# Altium schematic sheet SCH-00005-6.SchDoc: Test System DIN Connector
size 403 x 281 mm
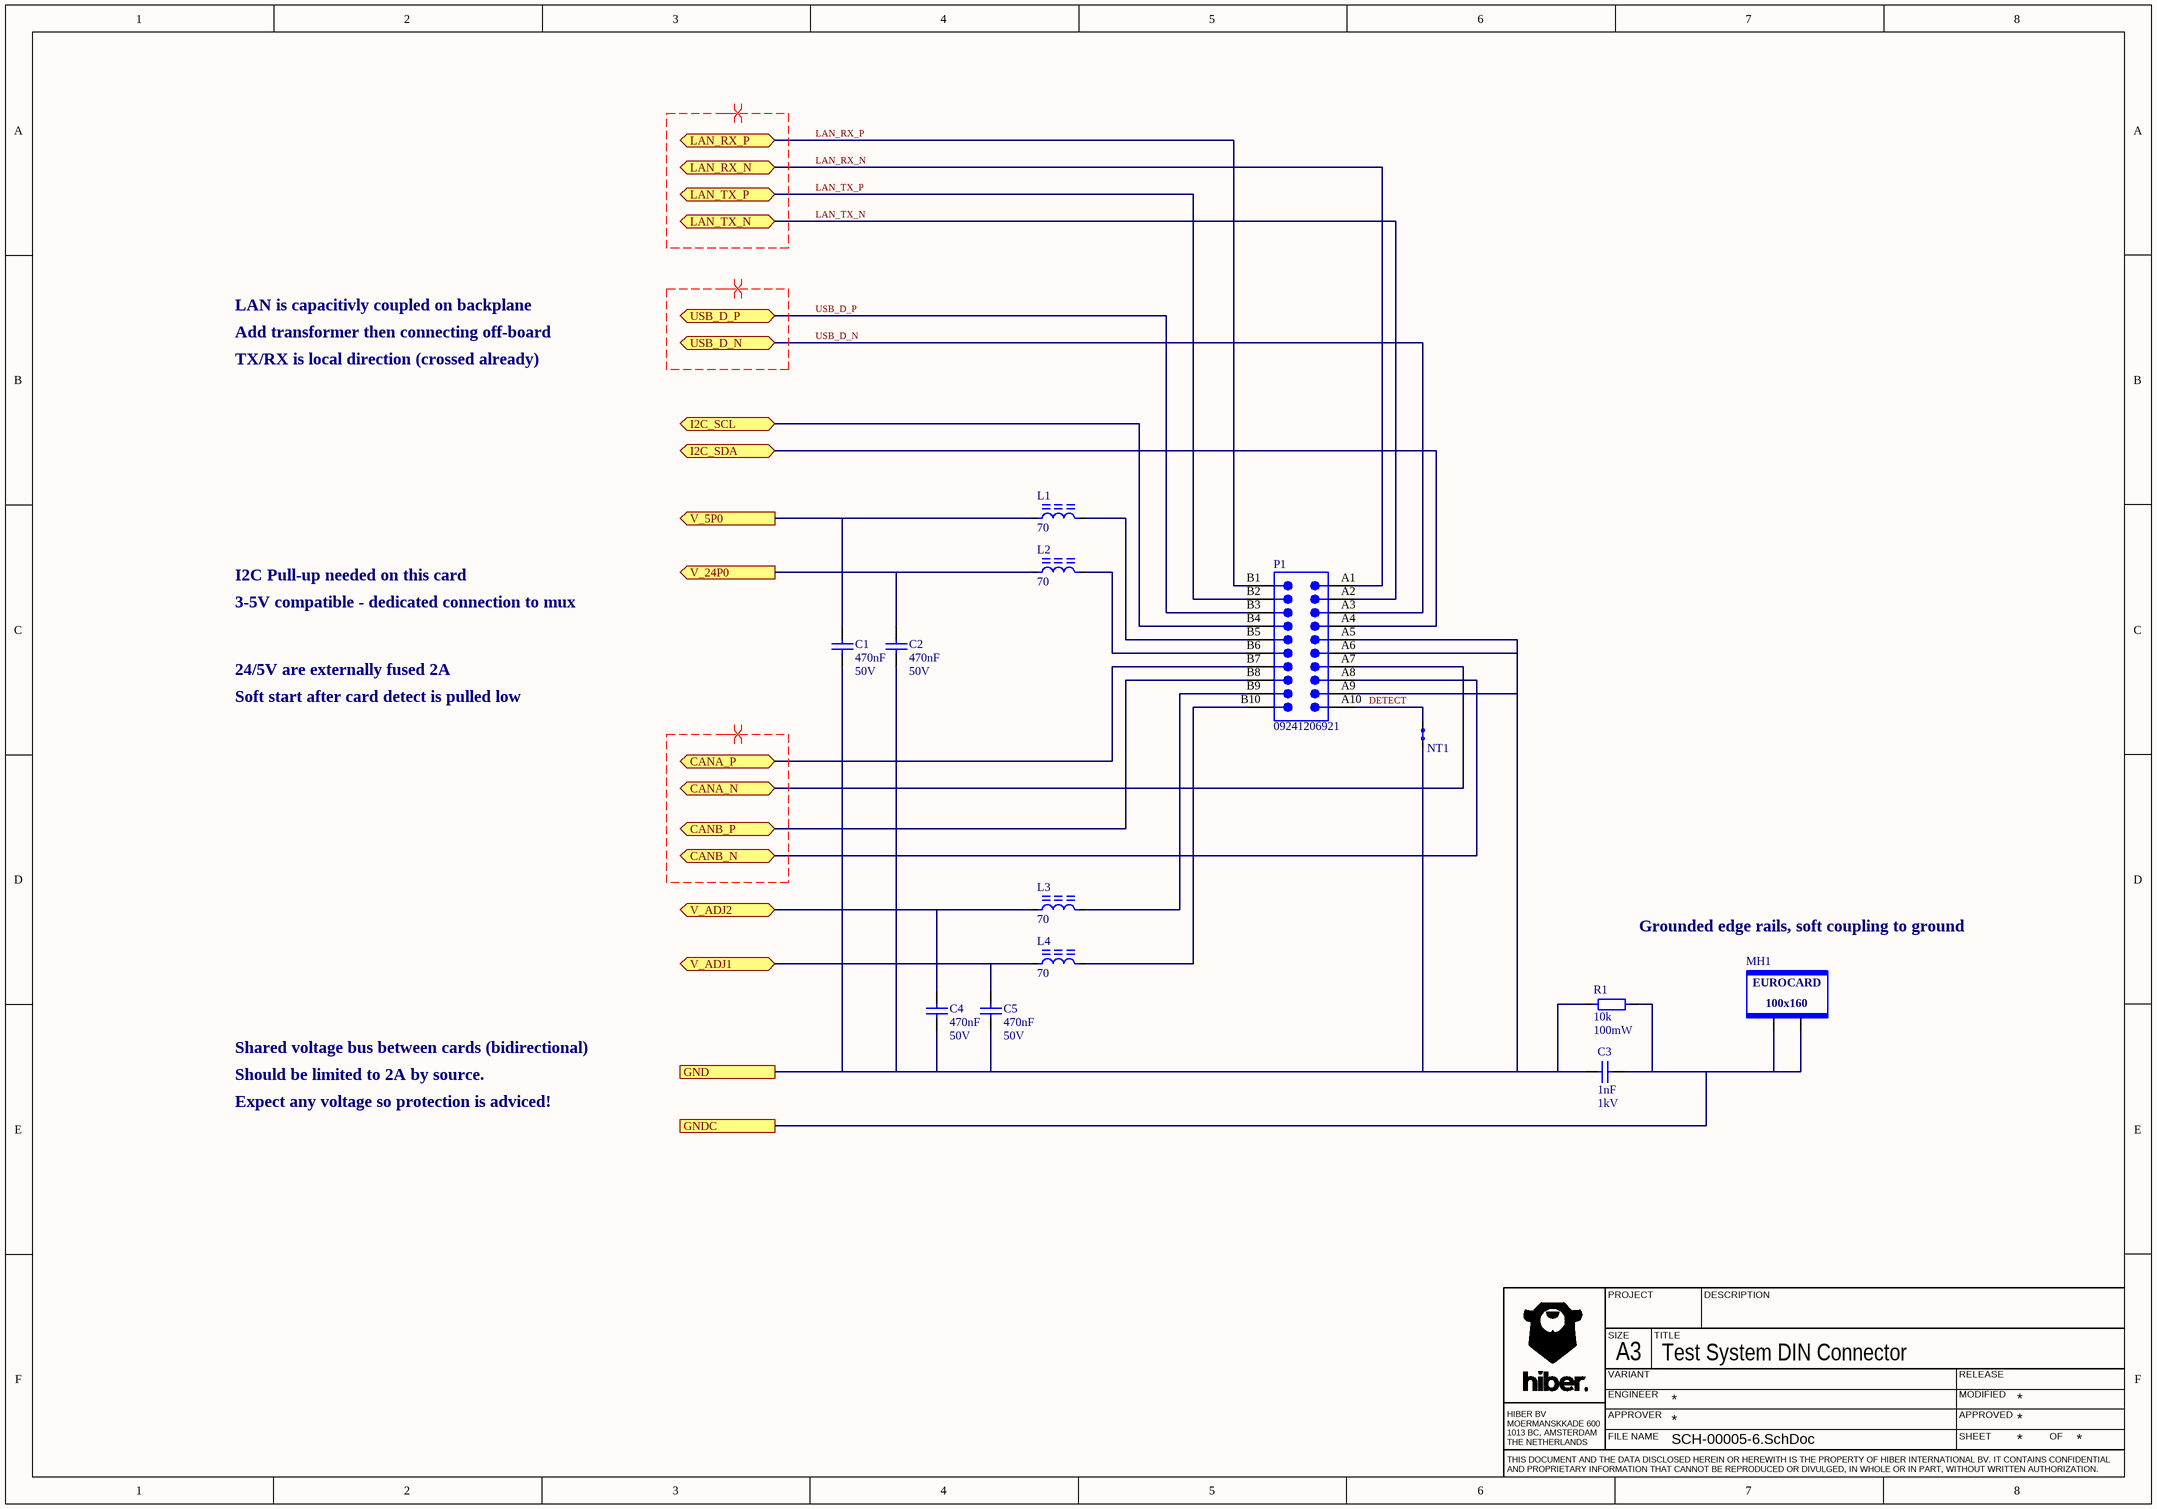
[diagram p0: SCH-00005-6.SchDoc]

## Parts
C1  value 470nF  Rated Voltage: 50V  [CAPC200X125X110L50N]  (hidden comment: C0805C474K5RACTU)
C2  value 470nF  Rated Voltage: 50V  [CAPC200X125X110L50N]  (hidden comment: C0805C474K5RACTU)
C3  value 1nF  Rated Voltage: 1kV  [CAPC160X80X87L35N]  (hidden comment: C0603W102KDRACAUTO)
C4  value 470nF  Rated Voltage: 50V  [CAPC200X125X110L50N]  (hidden comment: C0805C474K5RACTU)
C5  value 470nF  Rated Voltage: 50V  [CAPC200X125X110L50N]  (hidden comment: C0805C474K5RACTU)
L1  Impedance: 70  [BEADC200X125X105L50N]  (hidden comment: BLM21SP700SH1D)
L2  Impedance: 70  [BEADC200X125X105L50N]  (hidden comment: BLM21SP700SH1D)
L3  Impedance: 70  [BEADC200X125X105L50N]  (hidden comment: BLM21SP700SH1D)
L4  Impedance: 70  [BEADC200X125X105L50N]  (hidden comment: BLM21SP700SH1D)
MH1  EUROCARD_160X100  [EUROCARD_100X160]  (value not drawn)
NT1  NET-TIE  [NT200]  (value not drawn)  (net tie, no BOM)
P1  09241206921  [HARTING_09241206921]
R1  value 10k  Rated Power: 100mW  [RESC160X85X55L30N]  (hidden comment: TNPW060310K0BEEA)

## Ports
CANA_N (bidir), CANA_P (bidir), CANB_N (bidir), CANB_P (bidir), GND, GNDC, I2C_SCL (bidir), I2C_SDA (bidir), LAN_RX_N (bidir), LAN_RX_P (bidir), LAN_TX_N (bidir), LAN_TX_P (bidir), USB_D_N (bidir), USB_D_P (bidir), V_5P0 (out), V_24P0 (out), V_ADJ1 (bidir), V_ADJ2 (bidir)

## Nets
CANA_N: P1.A7 ; port CANA_N
CANA_P: P1.B7 ; port CANA_P
CANB_N: P1.A8 ; port CANB_N
CANB_P: P1.B8 ; port CANB_P
DETECT: NT1.2 P1.A10
GND: C1.1 C2.1 C3.2 C4.1 C5.1 NT1.1 P1.A5 P1.A6 P1.A9 R1.1 ; port GND
GNDC: C3.1 MH1.1 MH1.2 R1.2 ; port GNDC
I2C_SCL: P1.B4 ; port I2C_SCL
I2C_SDA: P1.A4 ; port I2C_SDA
LAN_RX_N: P1.A1 ; port LAN_RX_N
LAN_RX_P: P1.B1 ; port LAN_RX_P
LAN_TX_N: P1.A2 ; port LAN_TX_N
LAN_TX_P: P1.B2 ; port LAN_TX_P
USB_D_N: P1.A3 ; port USB_D_N
USB_D_P: P1.B3 ; port USB_D_P
V_5P0: C1.2 L1.1 ; port V_5P0
V_24P0: C2.2 L2.1 ; port V_24P0
V_ADJ1: C5.2 L4.1 ; port V_ADJ1
V_ADJ2: C4.2 L3.1 ; port V_ADJ2
NetL1_2: L1.2 P1.B5
NetL2_2: L2.2 P1.B6
NetL3_2: L3.2 P1.B9
NetL4_2: L4.2 P1.B10

## Layout directives
differential pair; differential pair class DIFF_LAN: (no net found under the mark)
differential pair; differential pair class DIFF_USB: (no net found under the mark)

## Notes on the sheet
- LAN is capacitivly coupled on backplane
- Add transformer then connecting off-board
- TX/RX is local direction (crossed already)
- I2C Pull-up needed on this card
- 3-5V compatible - dedicated connection to mux
- 24/5V are externally fused 2A
- Soft start after card detect is pulled low
- Grounded edge rails, soft coupling to ground
- Shared voltage bus between cards (bidirectional)
- Should be limited to 2A by source.
- Expect any voltage so protection is adviced!
- PROJECT
- DESCRIPTION
- SIZE
- ENGINEER
- VARIANT
- A3
- TITLE
- MODIFIED
- RELEASE
- HIBER BV
  MOERMANSKKADE 600
  1013 BC, AMSTERDAM
  THE NETHERLANDS
- FILE NAME
- APPROVER
- SHEET
- APPROVED
- OF
- THIS DOCUMENT AND THE DATA DISCLOSED HEREIN OR HEREWITH IS THE PROPERTY OF HIBER INTERNATIONAL BV. IT CONTAINS CONFIDENTIAL AND PROPRIETARY INFORMATION THAT CANNOT BE REPRODUCED OR DIVULGED, IN WHOLE OR IN PART, WITHOUT WRITTEN AUTHORIZATION.
- (in symbol CMP-01155-4) 100x160

## Library data of the parts
C1 C2 C4 C5 = CMP-00607-1: CAP Standard 0805 (2012) 470,0nF 50V X7R (Standard); Type: Ceramic; Tolerance: 10%; Termination Finish: 100% Matte Sn; Qualification: Standard; Mount: Surface Mount; Pins: 2; Case/Package: 0805 (2012); Dielectric: X7R; RoHS: Yes; Failure Rate: N/A
C3 = CMP-00534-3: CAP Automotive 0603 (1608) 1,0nF 1kV X7R (ArcShield with Flexible Termination); Tolerance: 10%; Type: Ceramic; Mount: SMD; Pins: 2; Dielectric: X7R; Failure Rate: N/A; RoHS: Yes; Qualification: Automotive; Case/Package: 0603 (1608); Termination Finish: 100% Matte Sn
L1-L4 = CMP-00632-1: IND, Automotive, Chip Ferrite Bead, Power Lines, 0805, 70R, 6A; Tolerance: 25%; Maximum DC Resistance: 9m; Case/Package: 0805 (2012); Qualification: Automotive; Termination Finish: Tin; Rated Current: 6A
MH1 = CMP-01155-4: Eurocard board outline 100x160mm
NT1 = CMP-00523-9: Net Tie, Inline
P1 = CMP-01160-3: Headers and Edge Type Connector; Connector Type: BOARD EURO CONNECTOR; Manufacturer Series: 09241206921; RoHS: Yes; Mount: TH
R1 = CMP-00643-1: RES High Stability Thin Film 0603 10K0 ±0.1% 0,1W; Qualification: Automotive; Rated Voltage: 75V; Case/Package: 0603 (1608); Mount: Surface Mount; Failure Rate: N/A; RoHS: Yes; Pins: 2; Type: High Stability Thin Film; Tolerance: 0.1%; Termination Finish: Pure tin termination finish